# Altium schematic sheet Load Switch.SchDoc
size B
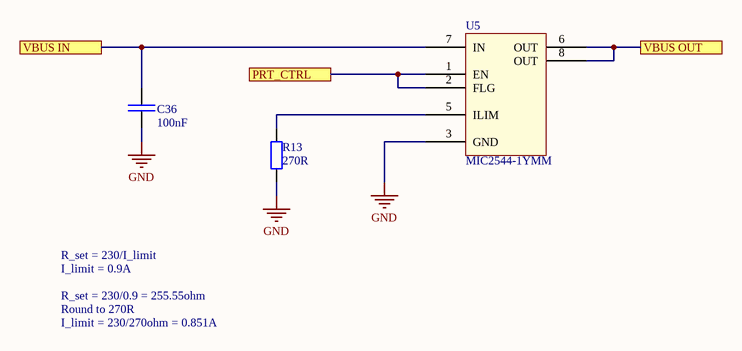
[diagram p0: Load Switch.SchDoc]

## Parts
C36  100nF  [CAP_SM0603_YAGEOCC2_N]
R13  270R  [RES_SM0603_YAGEORC_N]
U5  MIC2544-1YMM  [TSOP65P490X110-8N - MIC2544-1YMM]

## Ports
PRT_CTRL, VBUS IN, VBUS OUT

## Nets
GND: C36.2 R13.1 U5.3(GND)
PRT_CTRL: U5.1(EN) U5.2(FLG) ; port PRT_CTRL
VBUS IN: C36.1 U5.7(IN) ; port VBUS IN
VBUS OUT: U5.6(OUT) U5.8(OUT) ; port VBUS OUT
NetR13_2: R13.2 U5.5(ILIM)

## Notes on the sheet
- R_set = 230/I_limit
- I_limit = 0.9A
- R_set = 230/0.9 = 255.55ohm
- I_limit = 230/270ohm = 0.851A
- Round to 270R

## Library data of the parts
C36 = CC0603KRX7R9BB104: CAP 100nF SM0603 X7R 50V YAGEO CC2; Tolerance (%): 10; Voltage Rating (Volts): 50; Category: Capacitor; Manufacturer: Yageo; Manufacturer Part Number: CC0603KRX7R9BB104; Package: 0603; Value: 100nF; Supplier Part Number 1: 1362556; Supplier 1: Farnell; ComponentLink1URL: http://www.yageo.com; ComponentLink1Description: Manufacturer Website; Supplier 2: Digi-Key; Supplier Part Number 2: 311-1344-1-ND
R13 = RC0603FR-07270RL: RES 270R SM0603 YAGEO RC_L; Power (Watts): 0.1; Resistance (Ohms): 270; Tolerance (%): 1; Category: Resistor; Manufacturer: Yageo; Manufacturer Part Number: RC0603FR-07270RL; Package: 0603; Value: 270R; Supplier Part Number 1: 9238417; Supplier 1: Farnell; ComponentLink1URL: http://www.yageo.com; ComponentLink1Description: Manufacturer Website; Supplier 2: Digi-Key; Supplier Part Number 2: 311-270HRCT-ND
U5 = MIC2544-1YMM: IC PWR SWITCH N-CHAN 1:1 8MSOP